# Altium schematic sheet FET.SchDoc
size A
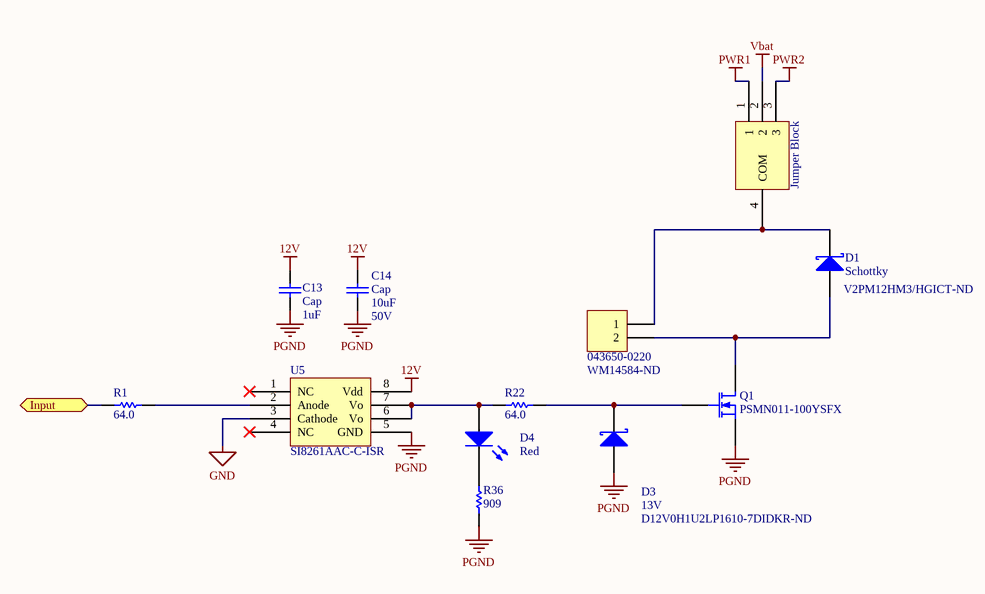
[diagram p0: FET.SchDoc]

## Parts
?  043650-0220  Vendor Part Number: WM14584-ND  [43650-0220]
C13  Cap  value 1uF  [RESC3116X65N]
C14  Cap  value 10uF  Voltage Rating: 50V  [CAPC3216X180N]
D1  Schottky  Vendor Part Number: V2PM12HM3/HGICT-ND  [V2PM12HM3/H]
D3  13V  Vendor Part Number: D12V0H1U2LP1610-7DIDKR-ND  [THRMC0603X33N]
D4  Color: Red  [THRMC0603X33N]  (hidden comment: LED0)
J1_FET1  Jumper Block  [Jumper Block]
Q1  PSMN011-100YSFX  [DPAK127P_600X120-5N]
R1  value 64.0  [0402]  (hidden comment: Res1)
R22  value 64.0  [0402]  (hidden comment: Res1)
R36  value 909  [0402]  (hidden comment: Res1)
U5  SI8261AAC-C-ISR  [SOIC127P599X175-8N]

## Ports
Input

## Nets
12V: C13.2 C14.2 U5.8(Vdd)
GND: U5.3(Cathode)
PGND: C13.1 C14.1 D3.3(A) Q1.3(S) R36.1 U5.5(GND)
PWR1: J1_FET1.1
PWR2: J1_FET1.3
Vbat: J1_FET1.2
Input: R1.1 ; port Input
Net?_1: ?.1 D1.1(K) J1_FET1.4(COM)
Net?_2: ?.2 D1.3(A) Q1.1(D)
NetD3_1: D3.1(K) Q1.2(G) R22.2
NetD4_1: D4.1(A) R22.1 U5.6(Vo) U5.7(Vo)
NetD4_3: D4.3(K) R36.2
NetR1_2: R1.2 U5.2(Anode)

Not connected (* = marked no-connect by the designer): U5 1(NC)* 4(NC)*

## Library data of the parts
? = Header 2: Header, 2-Pin; LatestRevisionDate: 17-Jul-2002; LatestRevisionNote: Re-released for DXP Platform.; Publisher: Altium Limited
C13 = Cap: Capacitor; Manufacturer Part Number: CL31B105KCHNNNE; Vendor Part Number: 1276-1838-1-ND
C14 = Cap: Capacitor; Manufacturer Part Number: CL31A106MBHNNNE; Vendor Part Number: 1276-6736-1-ND
D1 = Diode 10TQ040: TVS; Manufacturer Part Number: V2PM12HM3/H
D3 = Diode 10TQ040: TVS; Manufacturer Part Number: D12V0H1U2LP1610-7
D4 = LED0: Typical INFRARED GaAs LED; Vendor Part Number: 732-11991-1-ND; Manufacturer Part Number: 150040RS73240; Vf: 2V; I: 20mA
Q1 = MOSFET-N: N-Channel MOSFET; Vendor Part Number: 1727-8475-1-ND; Published: 8-Jun-2000; LatestRevisionDate: 17-Jul-2002; LatestRevisionNote: Re-released for DXP Platform.; PackageVersion: 1995/1996; PackageReference: E3; Publisher: Altium Limited; PackageDescription: TO, Flat Index; 3 In-Line, Axial Leads; Body Dia. 4.6mm; Lead Dia. 0.5 mm (max); Manufacturer Part Number: PSMN011-100YSFX
R1 R22 = Res1: Resistor; Manufacturer Part Number: RC0402FR-0760R4L; Vendor Part Number: 311-60.4LRCT-ND; Tolerance: 1%
R36 = Res1: Resistor; Manufacturer Part Number: RC0402FR-071K8L; Vendor Part Number: YAG3256CT-ND; Tolerance: 1%
U5 = SI8261AAC-C-ISR: Vendor Part Number: 336-4490-1-ND; Vendor: Digikey; Manufacturer Part Number: SI8261AAC-C-ISR